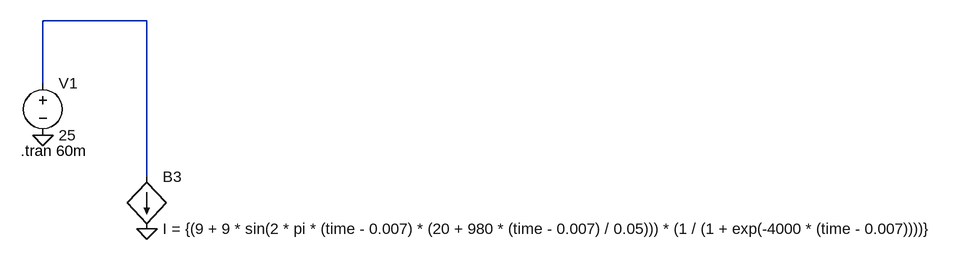
[diagram p0: schematic chirp function behavioral.asc]
chirp function behavioral.asc, the LTspice schematic file:
Version 4
SHEET 1 1596 680
WIRE 176 64 16 64
WIRE 16 160 16 64
WIRE 176 304 176 64
FLAG 16 240 0
FLAG 176 384 0
SYMBOL voltage 16 144 R0
WINDOW 123 0 0 Left 0
WINDOW 39 0 0 Left 0
SYMATTR InstName V1
SYMATTR Value 25
SYMBOL bi 176 304 R0
SYMATTR InstName B3
SYMATTR Value I = {(9 + 9 * sin(2 * pi * (time - 0.007) * (20 + 980 * (time - 0.007) / 0.05))) * (1 / (1 + exp(-4000 * (time - 0.007))))}
TEXT -18 264 Left 2 !.tran 60m

The netlist it stands for:
* chirp function behavioral.asc
V1 N001 0 25
B3 N001 0 I = {(9 + 9 * sin(2 * pi * (time - 0.007) * (20 + 980 * (time - 0.007) / 0.05))) * (1 / (1 + exp(-4000 * (time - 0.007))))}
.tran 60m
.backanno
.end